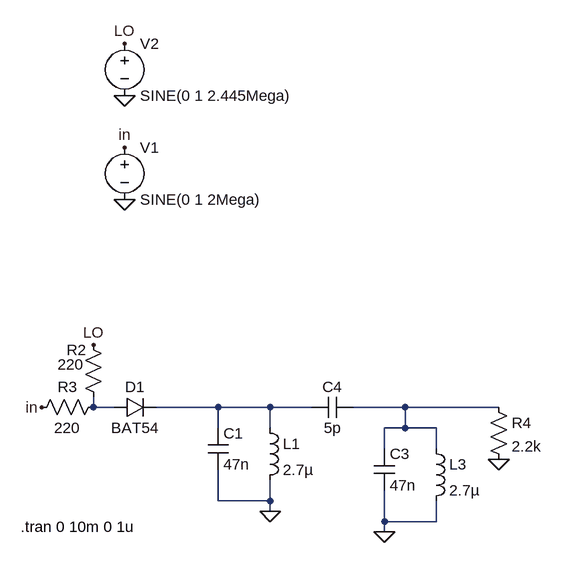
[diagram p0: schematic mixer.asc]
mixer.asc, the LTspice schematic file:
Version 4.1
SHEET 1 1016 680
WIRE -16 128 -16 112
WIRE 16 128 -16 128
WIRE 176 128 80 128
WIRE 256 128 176 128
WIRE 320 128 256 128
WIRE 464 128 384 128
WIRE 608 128 464 128
WIRE 176 160 176 128
WIRE 256 160 256 128
WIRE 464 160 464 128
WIRE 464 160 432 160
WIRE 512 160 464 160
WIRE 432 192 432 160
WIRE 512 192 512 160
WIRE 176 272 176 224
WIRE 256 272 256 240
WIRE 256 272 176 272
WIRE 256 288 256 272
WIRE 432 304 432 256
WIRE 512 304 512 272
WIRE 512 304 432 304
WIRE 432 320 432 304
FLAG -16 32 LO
FLAG -96 128 in
FLAG 32 -432 LO
FLAG 32 -272 in
FLAG 32 -192 0
FLAG 32 -352 0
FLAG 256 288 0
FLAG 608 208 0
FLAG 432 320 0
SYMBOL voltage 32 -288 R0
WINDOW 123 0 0 Left 0
WINDOW 39 0 0 Left 0
SYMATTR InstName V1
SYMATTR Value SINE(0 1 2Mega)
SYMBOL voltage 32 -448 R0
WINDOW 123 0 0 Left 0
WINDOW 39 0 0 Left 0
SYMATTR InstName V2
SYMATTR Value SINE(0 1 2.445Mega)
SYMBOL cap 160 160 R0
SYMATTR InstName C1
SYMATTR Value 47n
SYMBOL ind 240 144 R0
SYMATTR InstName L1
SYMATTR Value 2.7µ
SYMATTR SpiceLine Rser=1m
SYMBOL res -32 16 R0
WINDOW 0 -25 24 Left 2
WINDOW 3 -39 46 Left 2
SYMATTR InstName R2
SYMATTR Value 220
SYMBOL res 0 112 R90
WINDOW 0 0 56 VBottom 2
WINDOW 3 32 56 VTop 2
SYMATTR InstName R3
SYMATTR Value 220
SYMBOL diode 16 144 R270
WINDOW 0 32 32 VTop 2
WINDOW 3 0 32 VBottom 2
SYMATTR InstName D1
SYMATTR Value BAT54
SYMATTR Description Diode
SYMATTR Type diode
SYMBOL cap 416 192 R0
SYMATTR InstName C3
SYMATTR Value 47n
SYMBOL ind 496 176 R0
SYMATTR InstName L3
SYMATTR Value 2.7µ
SYMATTR SpiceLine Rser=1m
SYMBOL cap 384 112 R90
WINDOW 0 0 32 VBottom 2
WINDOW 3 32 32 VTop 2
SYMATTR InstName C4
SYMATTR Value 5p
SYMBOL res 592 112 R0
SYMATTR InstName R4
SYMATTR Value 2.2k
TEXT -128 312 Left 2 !.tran 0 10m 0 1u

The netlist it stands for:
* mixer.asc
V1 in 0 SINE(0 1 2Mega)
V2 LO 0 SINE(0 1 2.445Mega)
C1 N002 0 47n
L1 N002 0 2.7µ Rser=1m
R2 LO N001 220
R3 N001 in 220
D1 N001 N002 BAT54
C3 N003 0 47n
L3 N003 0 2.7µ Rser=1m
C4 N003 N002 5p
R4 N003 0 2.2k
.model D D
.lib standard.dio
.tran 0 10m 0 1u
.backanno
.end